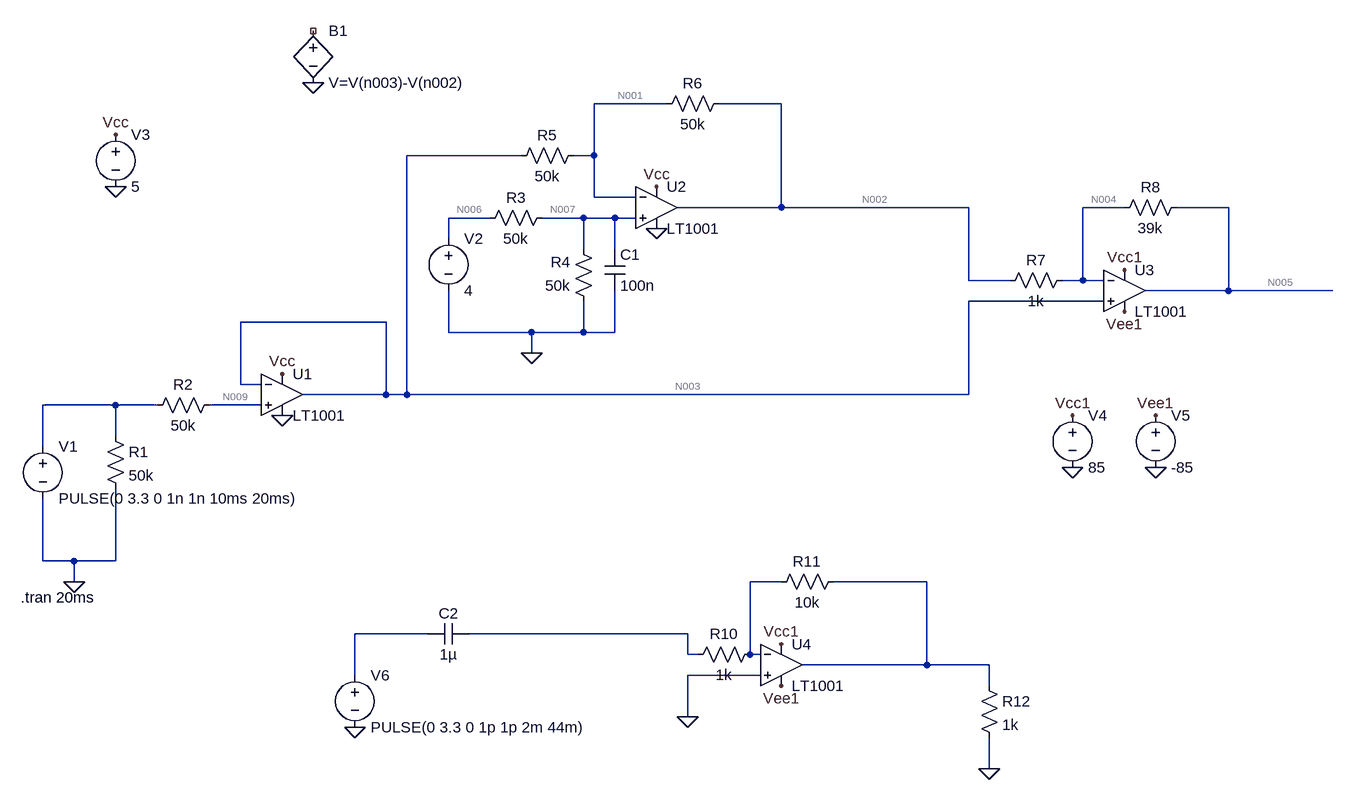
[diagram p0: schematic Draft3.asc]
Draft3.asc, the LTspice schematic file:
Version 4
SHEET 1 1636 680
WIRE 608 -384 496 -384
WIRE 784 -384 688 -384
WIRE 384 -304 208 -304
WIRE 496 -304 496 -384
WIRE 496 -304 464 -304
WIRE 496 -240 496 -304
WIRE 560 -240 496 -240
WIRE 784 -224 784 -384
WIRE 784 -224 624 -224
WIRE 1072 -224 784 -224
WIRE 1312 -224 1248 -224
WIRE 1472 -224 1392 -224
WIRE 336 -208 272 -208
WIRE 480 -208 416 -208
WIRE 528 -208 480 -208
WIRE 560 -208 528 -208
WIRE 272 -176 272 -208
WIRE 480 -160 480 -208
WIRE 528 -160 528 -208
WIRE 1072 -112 1072 -224
WIRE 1136 -112 1072 -112
WIRE 1248 -112 1248 -224
WIRE 1248 -112 1216 -112
WIRE 1280 -112 1248 -112
WIRE 1472 -96 1472 -224
WIRE 1472 -96 1344 -96
WIRE 1632 -96 1472 -96
WIRE 1280 -80 1072 -80
WIRE 176 -48 -48 -48
WIRE 272 -32 272 -96
WIRE 400 -32 272 -32
WIRE 480 -32 480 -80
WIRE 480 -32 400 -32
WIRE 528 -32 528 -96
WIRE 528 -32 480 -32
WIRE 400 0 400 -32
WIRE -48 48 -48 -48
WIRE -16 48 -48 48
WIRE 176 64 176 -48
WIRE 176 64 48 64
WIRE 208 64 208 -304
WIRE 208 64 176 64
WIRE 1072 64 1072 -80
WIRE 1072 64 208 64
WIRE -240 80 -352 80
WIRE -176 80 -240 80
WIRE -16 80 -96 80
WIRE -240 128 -240 80
WIRE -352 144 -352 80
WIRE -352 320 -352 224
WIRE -304 320 -352 320
WIRE -240 320 -240 208
WIRE -240 320 -304 320
WIRE -304 352 -304 320
WIRE 784 352 736 352
WIRE 1008 352 864 352
WIRE 240 432 128 432
WIRE 640 432 304 432
WIRE 640 464 640 432
WIRE 656 464 640 464
WIRE 736 464 736 352
WIRE 752 464 736 464
WIRE 1008 480 1008 352
WIRE 1008 480 816 480
WIRE 1104 480 1008 480
WIRE 128 496 128 432
WIRE 752 496 640 496
WIRE 1104 512 1104 480
WIRE 640 560 640 496
WIRE 1104 640 1104 592
FLAG 16 96 0
FLAG 592 -192 0
FLAG -240 -256 0
FLAG -240 -336 Vcc
FLAG 16 32 Vcc
FLAG 592 -256 Vcc
FLAG -304 352 0
FLAG 400 0 0
FLAG 64 -416 0
FLAG 1232 176 0
FLAG 1360 176 0
FLAG 1232 96 Vcc1
FLAG 1360 96 Vee1
FLAG 1312 -128 Vcc1
FLAG 1312 -64 Vee1
FLAG 128 576 0
FLAG 784 448 Vcc1
FLAG 784 512 Vee1
FLAG 640 560 0
FLAG 1104 640 0
SYMBOL Opamps\\LT1001 16 0 R0
SYMATTR InstName U1
SYMBOL voltage -352 128 R0
WINDOW 123 0 0 Left 2
WINDOW 39 0 0 Left 2
SYMATTR InstName V1
SYMATTR Value PULSE(0 3.3 0 1n 1n 10ms 20ms)
SYMBOL res -256 112 R0
SYMATTR InstName R1
SYMATTR Value 50k
SYMBOL res -80 64 R90
WINDOW 0 0 56 VBottom 2
WINDOW 3 32 56 VTop 2
SYMATTR InstName R2
SYMATTR Value 50k
SYMBOL Opamps\\LT1001 592 -288 R0
SYMATTR InstName U2
SYMBOL res 432 -224 R90
WINDOW 0 0 56 VBottom 2
WINDOW 3 32 56 VTop 2
SYMATTR InstName R3
SYMATTR Value 50k
SYMBOL res 496 -64 R180
WINDOW 0 36 76 Left 2
WINDOW 3 36 40 Left 2
SYMATTR InstName R4
SYMATTR Value 50k
SYMBOL cap 512 -160 R0
SYMATTR InstName C1
SYMATTR Value 100n
SYMBOL voltage 272 -192 R0
WINDOW 123 0 0 Left 2
WINDOW 39 0 0 Left 2
SYMATTR InstName V2
SYMATTR Value 4
SYMBOL res 480 -320 R90
WINDOW 0 0 56 VBottom 2
WINDOW 3 32 56 VTop 2
SYMATTR InstName R5
SYMATTR Value 50k
SYMBOL res 704 -400 R90
WINDOW 0 0 56 VBottom 2
WINDOW 3 32 56 VTop 2
SYMATTR InstName R6
SYMATTR Value 50k
SYMBOL voltage -240 -352 R0
WINDOW 123 0 0 Left 2
WINDOW 39 0 0 Left 2
SYMATTR InstName V3
SYMATTR Value 5
SYMBOL bv 64 -512 R0
SYMATTR InstName B1
SYMATTR Value V=V(n003)-V(n002)
SYMBOL Opamps\\LT1001 1312 -160 R0
SYMATTR InstName U3
SYMBOL voltage 1232 80 R0
WINDOW 123 0 0 Left 2
WINDOW 39 0 0 Left 2
SYMATTR InstName V4
SYMATTR Value 85
SYMBOL voltage 1360 80 R0
WINDOW 123 0 0 Left 2
WINDOW 39 0 0 Left 2
SYMATTR InstName V5
SYMATTR Value -85
SYMBOL res 1120 -96 R270
WINDOW 0 32 56 VTop 2
WINDOW 3 0 56 VBottom 2
SYMATTR InstName R7
SYMATTR Value 1k
SYMBOL res 1296 -208 R270
WINDOW 0 32 56 VTop 2
WINDOW 3 0 56 VBottom 2
SYMATTR InstName R8
SYMATTR Value 39k
SYMBOL voltage 128 480 R0
WINDOW 123 0 0 Left 2
WINDOW 39 0 0 Left 2
SYMATTR InstName V6
SYMATTR Value PULSE(0 3.3 0 1p 1p 2m 44m)
SYMBOL cap 304 416 R90
WINDOW 0 0 32 VBottom 2
WINDOW 3 32 32 VTop 2
SYMATTR InstName C2
SYMATTR Value 1µ
SYMBOL Opamps\\LT1001 784 416 R0
SYMATTR InstName U4
SYMBOL res 752 448 R90
WINDOW 0 0 56 VBottom 2
WINDOW 3 32 56 VTop 2
SYMATTR InstName R10
SYMATTR Value 1k
SYMBOL res 880 336 R90
WINDOW 0 0 56 VBottom 2
WINDOW 3 32 56 VTop 2
SYMATTR InstName R11
SYMATTR Value 10k
SYMBOL res 1088 496 R0
SYMATTR InstName R12
SYMATTR Value 1k
TEXT -386 376 Left 2 !.tran 20ms

The netlist it stands for:
* Draft3.asc
XU1 N009 N003 Vcc 0 N003 LT1001  ; pins In+ In- V+ V- OUT
V1 N008 0 PULSE(0 3.3 0 1n 1n 10ms 20ms)
R1 N008 0 50k
R2 N009 N008 50k
XU2 N007 N001 Vcc 0 N002 LT1001  ; pins In+ In- V+ V- OUT
R3 N007 N006 50k
R4 0 N007 50k
C1 N007 0 100n
V2 N006 0 4
R5 N001 N003 50k
R6 N002 N001 50k
V3 Vcc 0 5
B1 NC_01 0 V=V(n003)-V(n002)
XU3 N003 N004 Vcc1 Vee1 N005 LT1001  ; pins In+ In- V+ V- OUT
V4 Vcc1 0 85
V5 Vee1 0 -85
R7 N002 N004 1k
R8 N004 N005 39k
V6 N012 0 PULSE(0 3.3 0 1p 1p 2m 44m)
C2 N013 N012 1µ
XU4 0 N010 Vcc1 Vee1 N011 LT1001  ; pins In+ In- V+ V- OUT
R10 N010 N013 1k
R11 N011 N010 10k
R12 N011 0 1k
.tran 20ms
.lib LTC.lib
.backanno
.end

* Results of the author's LTspice run, read from the files saved beside the schematic
* Operating Point, zero values left out:
*   V(n003) = 930.4 mV
*   V(n009) = 627.8 µV
*   V(vcc) = 5 V
*   V(n001) = 2 V
*   V(n007) = 2 V
*   V(n002) = 3.07 V
*   V(n006) = 4 V
*   V(n004) = 930.5 mV
*   V(vcc1) = 85 V
*   V(vee1) = -85 V
*   V(n005) = -82.5 V
*   I(R8) = 2.139 mA
*   I(R7) = 2.139 mA
*   I(R6) = 21.39 µA
*   I(R5) = 21.39 µA
*   I(R4) = -40 µA
*   I(R3) = -40 µA
*   I(R2) = 12.56 nA
*   I(V5) = 5.697 mA
*   I(V4) = -3.558 mA
*   I(V3) = -5.703 mA
*   I(V2) = -40 µA
*   I(V1) = 12.56 nA
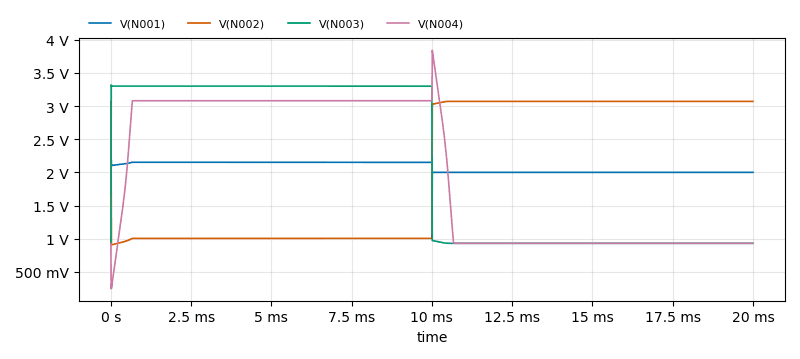
[diagram p1: Transient Analysis of Draft3.asc, plotted from the saved traces]
* Transient Analysis, 1 run:
*   V(N001): min 1.536 V, max 2.184 V, average 2.075 V, rms 2.076 V, last 2 V
*   V(N002): min 907.2 mV, max 3.07 V, average 2.035 V, rms 2.282 V, last 3.07 V
*   V(N003): min 930.4 mV, max 3.317 V, average 2.115 V, rms 2.424 V, last 930.4 mV
*   V(N004): min 244.7 mV, max 3.839 V, average 2.006 V, rms 2.274 V, last 930.5 mV